# EAGLE design AudioAppBoard-0BAC0606 (EAGLE 5.10)
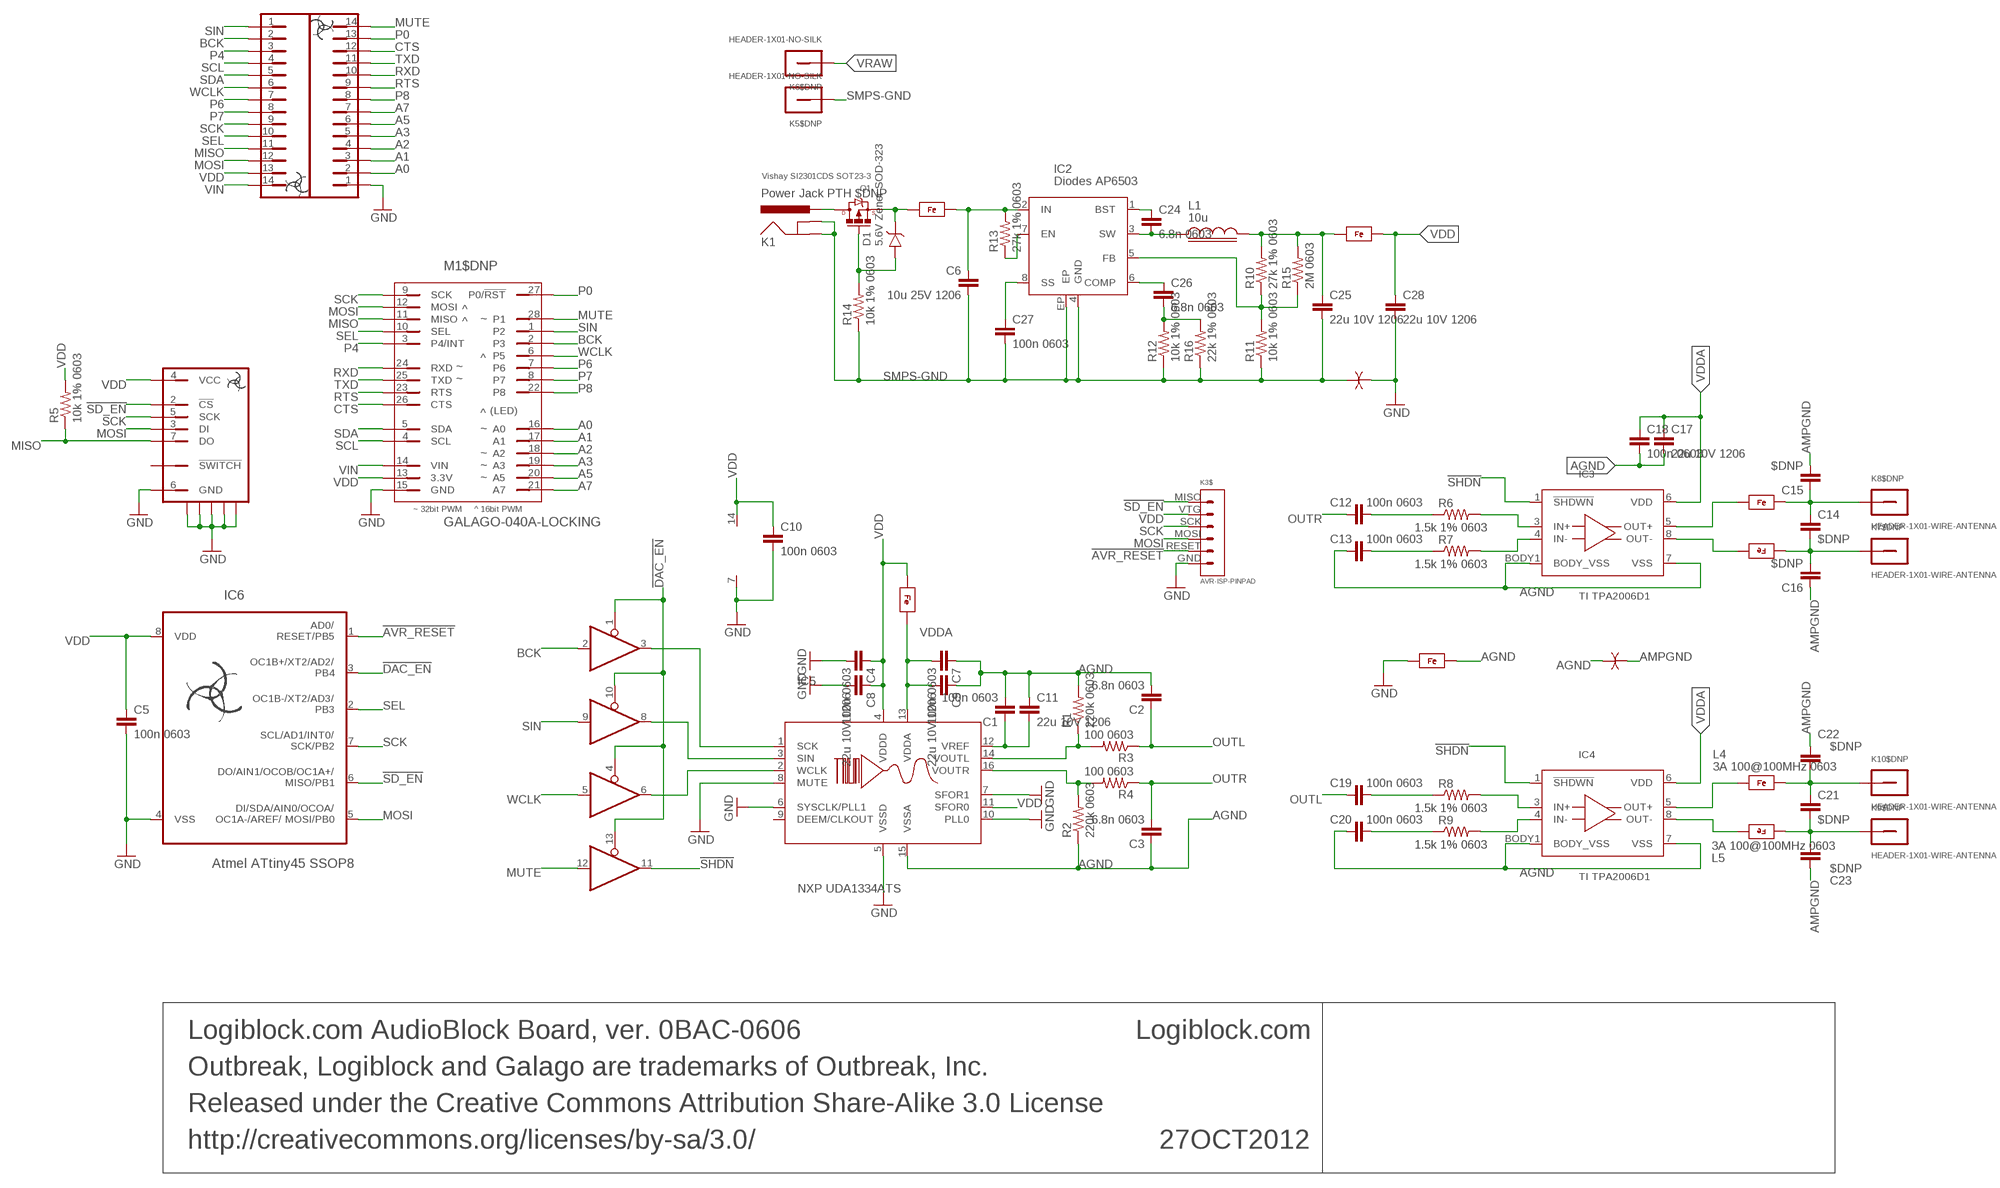
[diagram p0: schematic, sheet 1]

## Parts
27OCT2012  Logiblock.com AudioBlock Board, ver. 0BAC-0606  INFO-BLOCK  [INFO-BLOCK]
C1  100n 0603  CAP-0603  [0603]
C2  6.8n 0603  CAP-0603  [0603]
C3  6.8n 0603  CAP-0603  [0603]
C4  100n 0603  CAP-0603  [0603]
C5  100n 0603  CAP-0603  [0603]
C6  10u 25V 1206  CAP-1206  [1206]
C7  100n 0603  CAP-0603  [0603]
C8  22u 10V 1206  CAP-1206  [1206]
C9  22u 10V 1206  CAP-1206  [1206]
C10  100n 0603  CAP-0603  [0603]
C11  22u 10V 1206  CAP-1206  [1206]
C12  100n 0603  CAP-0603-MIN  [0603-MIN]
C13  100n 0603  CAP-0603-MIN  [0603-MIN]
C14  $DNP  CAP-0603-MIN  [0603-MIN]
C15  $DNP  CAP-0603-MIN  [0603-MIN]
C16  $DNP  CAP-0603-MIN  [0603-MIN]
C17  22u 10V 1206  CAP-1206  [1206]
C18  100n 0603  CAP-0603-MIN  [0603-MIN]
C19  100n 0603  CAP-0603-MIN  [0603-MIN]
C20  100n 0603  CAP-0603-MIN  [0603-MIN]
C21  $DNP  CAP-0603-MIN  [0603-MIN]
C22  $DNP  CAP-0603-MIN  [0603-MIN]
C23  $DNP  CAP-0603-MIN  [0603-MIN]
C24  6.8n 0603  CAP-0603-MIN  [0603-MIN]
C25  22u 10V 1206  CAP-1206  [1206]
C26  6.8n 0603  CAP-0603-MIN  [0603-MIN]
C27  100n 0603  CAP-0603-MIN  [0603-MIN]
C28  22u 10V 1206  CAP-1206  [1206]
D1  5.6V Zener SOD-323  DIODE-ZENER-SOD323  [SOD323]
FB1  3A 100@100MHz 0603  FERRITE-BEAD-0603  [0603]
FB2  3A 100@100MHz 0603  FERRITE-BEAD-0603  [0603]
FB3  3A 100@100MHz 0603  FERRITE-BEAD-0603  [0603]
FB4  3A 100@100MHz 0603  FERRITE-BEAD-0603-MIN  [0603-MIN]
IC1  74HC125-TSSOP14  [TSSOP14]
IC2  Diodes AP6503  SWITCHING-REGULATOR-VARIABLE-BUCK-DIODES-AP6503  [EIAJ-SOIC8-3.9MM-EXPOSED-PAD]
IC3  TI TPA2006D1  AMP-AUDIO-CLASS-D-TI-TPA2006A  [QFN8-3X3MM-TI-TPA200X]
IC4  TI TPA2006D1  AMP-AUDIO-CLASS-D-TI-TPA2006A  [QFN8-3X3MM-TI-TPA200X]
IC5  NXP UDA1334ATS  AUDIO-DAC-NXP-UDA1334ATS  [TSSOP16]
IC6  Atmel ATtiny45 SSOP8  AVR-ATTINY25/45/85-TSSOP8  [TSSOP8-4.4MM]
K1  Power Jack PTH $DNP  POWER_JACKPTH  [POWER_JACK_PTH]
K2  HIROSE-DM3D-SF-MICROSD  SD-OR-MICROSD-SPI-MODE-WITH-SWITCH-HIROSE-DM3D-SF  [HIROSE-MICROSD-SOCKET-DM3D-SF]
K2$DNP  HEADER-1X14-NO-SILK-CHUNKY  [HEADER-1X14-NO-SILK-CHUNKY]
K3$  AVR-ISP-PINPAD  [AVR-ISP-PINPAD]
K4$DNP  HEADER-1X14-NO-SILK-CHUNKY  [HEADER-1X14-NO-SILK-CHUNKY]
K5$DNP  HEADER-1X01-NO-SILK  [HEADER-1X01-NO-SILK]
K6$DNP  HEADER-1X01-NO-SILK  [HEADER-1X01-NO-SILK]
K7$DNP  HEADER-1X01-WIRE-ANTENNA  [HEADER-1X01-WIRE-ANTENNA]
K8$DNP  HEADER-1X01-WIRE-ANTENNA  [HEADER-1X01-WIRE-ANTENNA]
K9$DNP  HEADER-1X01-WIRE-ANTENNA  [HEADER-1X01-WIRE-ANTENNA]
K10$DNP  HEADER-1X01-WIRE-ANTENNA  [HEADER-1X01-WIRE-ANTENNA]
L1  10u  INDUCTOR-6X6MM  [INDUCTOR-SMD-6X6MM]
L2  3A 100@100MHz 0603  FERRITE-BEAD-0603-MIN  [0603-MIN]
L3  3A 100@100MHz 0603  FERRITE-BEAD-0603-MIN  [0603-MIN]
L4  3A 100@100MHz 0603  FERRITE-BEAD-0603-MIN  [0603-MIN]
L5  3A 100@100MHz 0603  FERRITE-BEAD-0603-MIN  [0603-MIN]
M1$DNP  GALAGO-040A-LOCKING  [GALAGO-LOCKING]
Q1  Vishay SI2301CDS SOT23-3  MOSFET-P-CHANNEL-VISHAY-SI2301  [SOT23-3]
R1  220k 0603  RESISTOR-0603  [0603]
R2  220k 0603  RESISTOR-0603  [0603]
R3  100 0603  RESISTOR-0603  [0603]
R4  100 0603  RESISTOR-0603  [0603]
R5  10k 1% 0603  RESISTOR-0603-MIN  [0603-MIN]
R6  1.5k 1% 0603  RESISTOR-0603-MIN  [0603-MIN]
R7  1.5k 1% 0603  RESISTOR-0603-MIN  [0603-MIN]
R8  1.5k 1% 0603  RESISTOR-0603-MIN  [0603-MIN]
R9  1.5k 1% 0603  RESISTOR-0603-MIN  [0603-MIN]
R10  27k 1% 0603  RESISTOR-0603-MIN  [0603-MIN]
R11  10k 1% 0603  RESISTOR-0603-MIN  [0603-MIN]
R12  10k 1% 0603  RESISTOR-0603-MIN  [0603-MIN]
R13  27k 1% 0603  RESISTOR-0603-MIN  [0603-MIN]
R14  10k 1% 0603  RESISTOR-0603-MIN  [0603-MIN]
R15  2M 0603  RESISTOR-0603-MIN  [0603-MIN]
R16  22k 1% 0603  RESISTOR-0603-MIN  [0603-MIN]
U1$  GND-ISOLATOR-0.008"  [GND-ISOLATOR-0.008"]
U2$  GND-ISOLATOR-0.008"  [GND-ISOLATOR-0.008"]

## Nets
!AVR_RESET: IC6.1(RESET/PB5) K3$.RESET
!DAC_EN: IC1.1(EN) IC1.4(EN) IC1.10(EN) IC1.13(EN) IC6.3(PB4)
!SD_EN: IC6.6(MISO/PB1) K2.2(!CS) K3$.MISO
!SHDN: IC1.11(Y) IC3.1(!SHDWN) IC4.1(!SHDWN)
A0: K4$DNP.2 M1$DNP.16(A0)
A1: K4$DNP.3 M1$DNP.17(A1)
A2: K4$DNP.4 M1$DNP.18(A2)
A3: K4$DNP.5 M1$DNP.19(A3)
A5: K4$DNP.6 M1$DNP.20(A5)
A7: K4$DNP.7 M1$DNP.21(A7)
AGND: C1.1 C2.1 C3.2 C7.2 C9.2 C11.2 C13.2 C17.1 C18.1 C20.2 FB4.2 IC3.7(VSS) IC3.BODY1(BODY_VSS) IC4.7(VSS) IC4.BODY1(BODY_VSS) IC5.15(VSSA) R1.2 R2.1 U2$.1(A)
AMPGND: C15.1 C16.2 C22.1 C23.2 U2$.2(B)
BCK: IC1.2(A) K2$DNP.2 M1$DNP.2(P3)
CTS: K4$DNP.12 M1$DNP.26(CTS)
DAC_SCK: IC1.3(Y) IC5.1(SCK)
DAC_SIN: IC1.8(Y) IC5.3(SIN)
DAC_WCLK: IC1.6(Y) IC5.2(WCLK)
GND: C4.1 C5.1 C8.1 C10.1 C28.1 FB4.1 IC1.7(VSS) IC5.5(VSSD) IC5.6(SYSCLK/PLL1) IC5.7(SFOR1) IC5.8(MUTE) IC5.10(PLL0) IC6.4(VSS) K2.6(GND) K2.PP$1 K2.PP$2 K2.PP$3 K2.PP$4 K2.PP$5 K3$.GND K4$DNP.1 M1$DNP.15(GND) U1$.2(B)
MISO: K2$DNP.11 K2.7(DO) M1$DNP.11(MISO) R5.1
MOSI: IC6.5(MOSI/PB0) K2$DNP.12 K2.3(DI) K3$.MOSI M1$DNP.12(MOSI)
MUTE: IC1.12(A) K4$DNP.14 M1$DNP.28(P1)
N$1: C14.2 C15.2 K8$DNP.1 L2.2
N$2: IC4.5(OUT+) L4.1
N$3: IC3.5(OUT+) L2.1
N$4: IC3.8(OUT-) L3.2
N$5: C12.1 R6.1
N$6: D1.A Q1.1(GATE) R14.2
N$7: C13.1 R7.1
N$8: IC3.4(IN-) R7.2
N$9: IC3.3(IN+) R6.2
N$10: C14.1 C16.1 K7$DNP.1 L3.1
N$11: IC4.8(OUT-) L5.2
N$12: C19.1 R8.1
N$13: C20.1 R9.1
N$14: IC4.4(IN-) R9.2
N$15: IC4.3(IN+) R8.2
N$18: C21.2 C22.2 K10$DNP.1 L4.2
N$19: C21.1 C23.1 K9$DNP.1 L5.1
N$23: D1.K FB1.1 Q1.2(SOURCE)
N$27: C26.1 R12.2 R16.2
OUTL: C2.2 C19.2 R3.1
OUTR: C3.1 C12.2 R4.1
P0: K4$DNP.13 M1$DNP.27(P0/!RST)
P4: K2$DNP.3 M1$DNP.3(P4/INT)
P6: K2$DNP.7 M1$DNP.7(P6)
P7: K2$DNP.8 M1$DNP.8(P7)
P8: K4$DNP.8 M1$DNP.22(P8)
RTS: K4$DNP.9 M1$DNP.23(RTS)
RXD: K4$DNP.10 M1$DNP.24(RXD)
SCK: IC6.7(SCK/PB2) K2$DNP.9 K2.5(SCK) K3$.SCK M1$DNP.9(SCK)
SCL: K2$DNP.4 M1$DNP.4(SCL)
SDA: K2$DNP.5 M1$DNP.5(SDA)
SEL: IC6.2(PB3) K2$DNP.10 M1$DNP.10(SEL)
SIN: IC1.9(A) K2$DNP.1 M1$DNP.1(P2)
SMPS-BST: C24.2 IC2.1(BST)
SMPS-COMP: C26.2 IC2.6(COMP)
SMPS-EN: IC2.7(EN) R13.1
SMPS-FB: IC2.5(FB) R10.1 R11.2 R15.1
SMPS-GND: C6.1 C25.1 C27.1 IC2.4(GND) IC2.EP K1.GND K1.GNDBREAK K5$DNP.1 R11.1 R12.1 R14.1 R16.1 U1$.1(A)
SMPS-IN: C6.2 FB1.2 IC2.2(IN) R13.2
SMPS-OUT: C25.2 FB2.1 L1.2 R10.2 R15.2
SMPS-SS: C27.2 IC2.8(SS)
SMPS-SW: C24.1 IC2.3(SW) L1.1
TXD: K4$DNP.11 M1$DNP.25(TXD)
VDD: C4.2 C5.2 C8.2 C10.2 C28.2 FB2.2 FB3.1 IC1.14(VDD) IC5.4(VDDD) IC5.11(SFOR0) IC6.8(VDD) K2$DNP.13 K2.4(VCC) K3$.VTG M1$DNP.13(3.3V) R5.2
VDDA: C7.1 C9.1 C17.2 C18.2 FB3.2 IC3.6(VDD) IC4.6(VDD) IC5.13(VDDA)
VIN: K2$DNP.14 M1$DNP.14(VIN)
VOUTL: IC5.14(VOUTL) R1.1 R3.2
VOUTR: IC5.16(VOUTR) R2.2 R4.2
VRAW: K1.PWR K6$DNP.1 Q1.3(DRAIN)
VREF: C1.2 C11.1 IC5.12(VREF)
WCLK: IC1.5(A) K2$DNP.6 M1$DNP.6(P5)
Unconnected: IC5.9(DEEM/CLKOUT) K2.SWITCH(!SWITCH)

## Library data of the parts
27OCT2012 = Outbreak:INFO-BLOCK
C1-C28 = Outbreak:CAP
D1 = Outbreak:DIODE-ZENER
FB1-FB4 L2-L5 = Outbreak:FERRITE-BEAD
IC1 = Outbreak:74HC125
IC2 = Outbreak:SWITCHING-REGULATOR-VARIABLE-BUCK-DIODES-AP6503
IC3 IC4 = Outbreak:AMP-AUDIO-CLASS-D-TI-TPA2006A
IC5 = Outbreak:AUDIO-DAC-NXP-UDA1334ATS
IC6 = Outbreak:AVR-ATTINY25/45/85
K1 = Outbreak:POWER_JACK: Power Jack This is the standard 5.5mm barrel jack for power. The PTH is the most common, proven, reliable, footprint. All others are experimental. The Slot footprint only works if the mill layer is transmitted to the PCB fab house so be warned. Spark Fun Electronics SKU : PRT-00119. Mating wall wart : TOL-00298 (and others)
K2 = Outbreak:SD-OR-MICROSD-SPI-MODE-WITH-SWITCH
K2$DNP K4$DNP = Outbreak:HEADER-1X14-NO-SILK
K3$ = Outbreak:AVR-ISP-PINPAD
K5$DNP K6$DNP K7$DNP K8$DNP K9$DNP K10$DNP = Outbreak:HEADER-1X01
L1 = Outbreak:INDUCTOR
M1$DNP = Outbreak-v0:GALAGO-040A
Q1 = Outbreak:MOSFET-P-CHANNEL
R1-R16 = Outbreak:RESISTOR: Resistor Basic schematic elements and footprints for 0603, 1206, and PTH resistors.
U1$ U2$ = Outbreak:GND-ISOLATOR

## Board
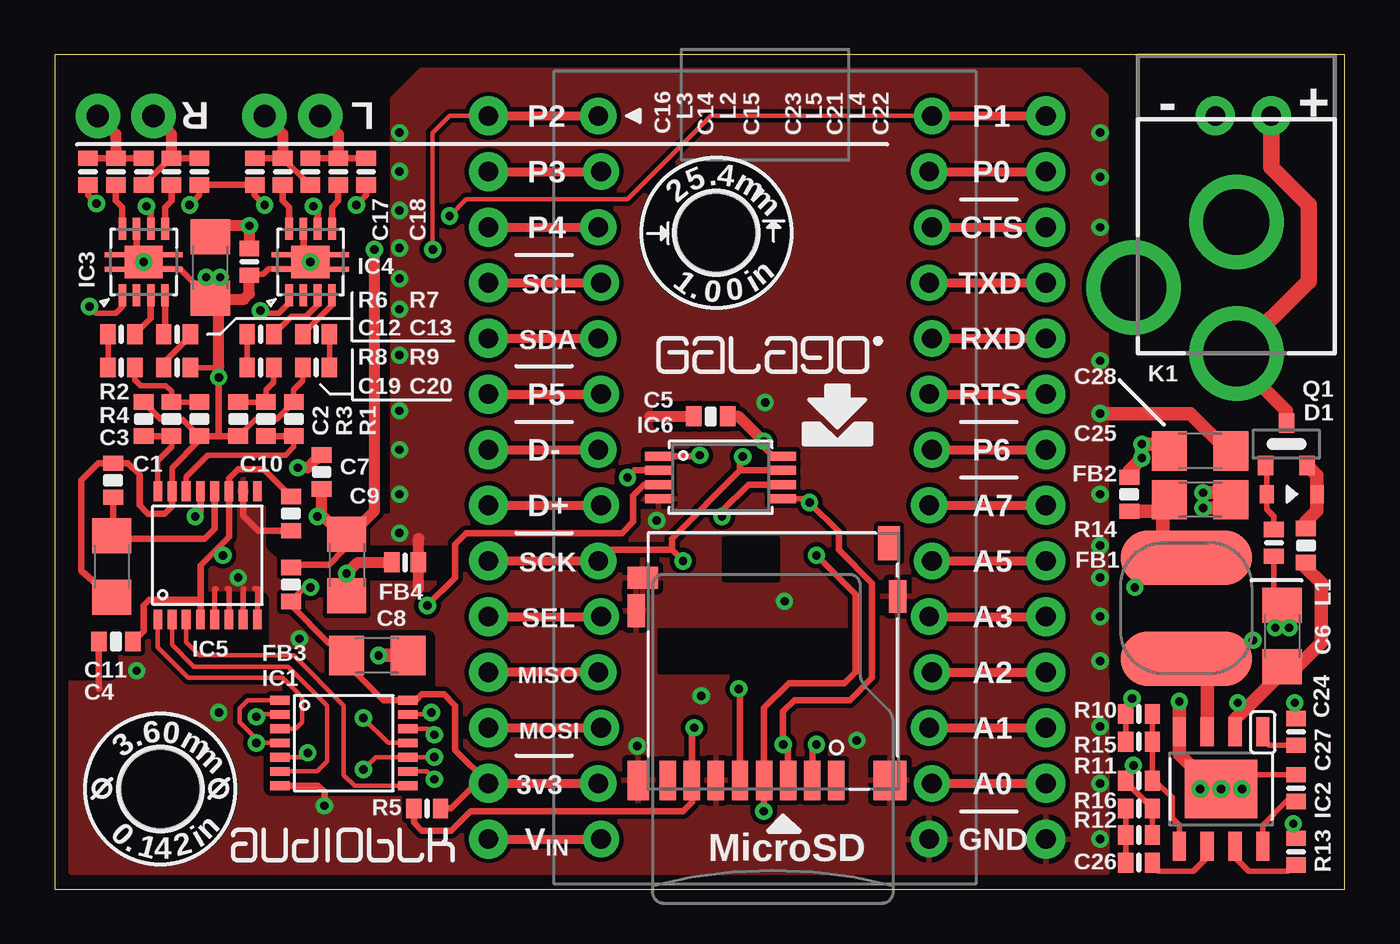
[diagram p1: board, top side]
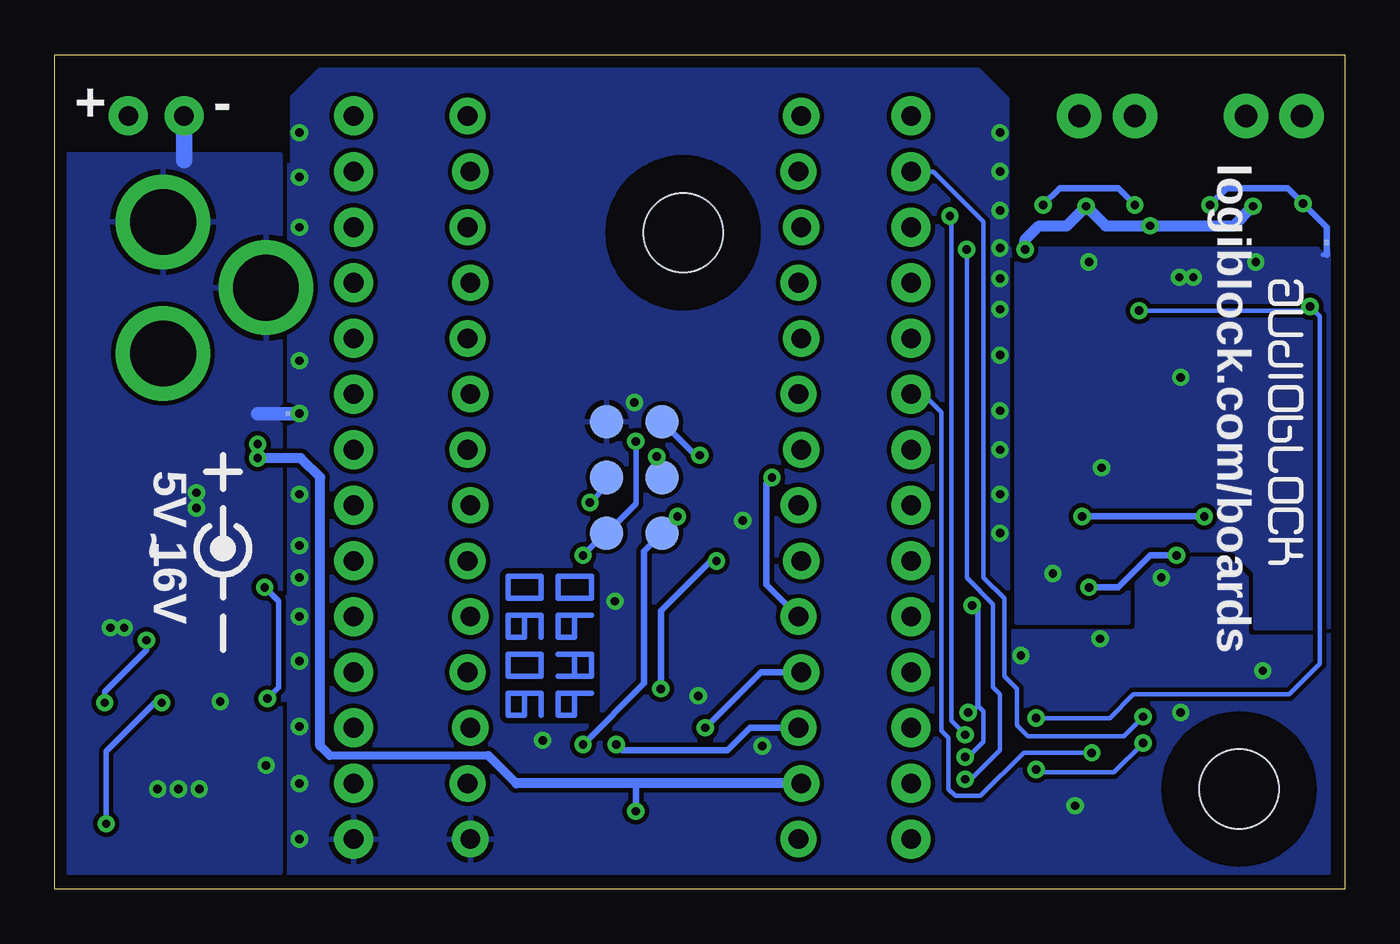
[diagram p2: board, bottom side, seen from below]

Size 58.93 x 38.1 mm. Coordinates in mm from the lower left corner, seen from the top.
Outline: 0,0 58.93,0 58.93,38.1 0,38.1 0,0
Copper layers (1*16): Top 0.035mm / dielectric 1.5mm / Bottom 0.035mm
Design rules: minimum track width 8mil, minimum drill 15mil, track to track 8mil, track to pad 8mil, pad to pad 8mil, via to via 8mil, smd to smd 8mil, copper to edge 20mil, drill to drill 8mil, minimum pad ring 10mil, minimum via ring 8mil, stop-mask expansion 4mil, vias tented up to drill 20mil, thermal gap 10mil
tRestrict: area 27.7,21.3 to 30.8,21.9; area 0.5,9.9 to 2.5,11.7; area 6.6,11.2 to 9.4,13.2; area 9.9,4.6 to 17.3,6.6; area 10,15.5 to 11.9,18; area 12.7,9.4 to 17,11.5; area 14.4,14.5 to 18,15.3
bRestrict: area 34.4,7.9 to 38.2,14.3

### Footprints (pad centres in the part's own frame; a part is rotated, then mirrored left to right if it is on the bottom)
0603 = smd 0.7 x 0.9: 1 -0.777,0; 2 0.777,0
1206 = smd 1.6 x 1.8: 1 -1.4,0; 2 1.4,0
0603-MIN = smd 0.7 x 0.9: 1 -0.61,0; 2 0.61,0
SOD323 = smd 0.63 x 0.83: A -1.15,0; K 1.15,0
TSSOP14 = smd 0.4 x 0.9: 1 2.275,2.925; 2 1.625,2.925; 3 0.975,2.925; 4 0.325,2.925; 5 -0.325,2.925; 6 -0.975,2.925; 7 -1.625,2.925; 8 -1.625,-2.925; 9 -0.975,-2.925; 10 -0.325,-2.925; 11 0.325,-2.925; 12 0.975,-2.925; 13 1.625,-2.925; 14 2.275,-2.925
EIAJ-SOIC8-3.9MM-EXPOSED-PAD = smd 1.321 x 0.61: 1 -2.618,1.905; 2 -2.618,0.635; 3 -2.618,-0.635; 4 -2.618,-1.905; 5 2.618,-1.905; 6 2.618,-0.635; 7 2.618,0.635; 8 2.618,1.905 | smd 2.66 x 3.3: EP 0,0
QFN8-3X3MM-TI-TPA200X = smd 0.35 x 1: 1 0.975,1.525; 2 0.325,1.525; 3 -0.325,1.525; 4 -0.975,1.525; 5 -0.985,-1.525; 6 -0.325,-1.525; 7 0.325,-1.525; 8 0.975,-1.525 | smd 1.75 x 1.5: BODY1 0,0 | smd 0.9 x 0.23: BODY2 -1.325,0.325; BODY3 -1.325,-0.325; BODY4 1.325,-0.325; BODY5 1.325,0.325
TSSOP16 = smd 0.4 x 0.9: 1 2.275,2.925; 2 1.625,2.925; 3 0.975,2.925; 4 0.325,2.925; 5 -0.325,2.925; 6 -0.975,2.925; 7 -1.625,2.925; 8 -2.275,2.925; 9 -2.275,-2.925; 10 -1.625,-2.925; 11 -0.975,-2.925; 12 -0.325,-2.925; 13 0.325,-2.925; 14 0.975,-2.925; 15 1.625,-2.925; 16 2.275,-2.925
TSSOP8-4.4MM = smd 1.25 x 0.42: 1 -2.825,0.975; 2 -2.825,0.325; 3 -2.825,-0.325; 4 -2.825,-0.975; 5 2.825,-0.975; 6 2.825,-0.325; 7 2.825,0.325; 8 2.825,0.975
POWER_JACK_PTH = drill 2.997 pad 4.318: GND 0,7.7; GNDBREAK 4.7,10.7; PWR 0,13.7
HIROSE-MICROSD-SOCKET-DM3D-SF = smd 0.75 x 1.8: 1 2.62,-4.18; 2 1.52,-4.18; 3 0.42,-4.18; 4 -0.68,-4.18; 5 -1.78,-4.18; 6 -2.88,-4.18; 7 -3.98,-4.18; 8 -5.08,-4.18 | smd 1.4 x 1: PP$1 -6.23,5.07 | smd 0.8 x 1.5: PP$2 -6.53,3.57; PP$5 5.42,4.22 | smd 1 x 1.8: PP$3 -6.43,-4.18 | smd 1.5 x 1.8: PP$4 5.07,-4.18 | smd 1 x 1.55: SWITCH 5.02,6.645
HEADER-1X14-NO-SILK-CHUNKY = drill 0.9 pad 1.778: 1 0,0; 2 2.54,0; 3 5.08,0; 4 7.62,0; 5 10.16,0; 6 12.7,0; 7 15.24,0; 8 17.78,0; 9 20.32,0; 10 22.86,0; 11 25.4,0; 12 27.94,0; 13 30.48,0; 14 33.02,0
AVR-ISP-PINPAD = smd 1.524 x 1.524: GND 2.54,1.27; MISO -2.54,-1.27; MOSI 0,1.27; RESET 2.54,-1.27; SCK 0,-1.27; VTG -2.54,1.27
HEADER-1X01-NO-SILK = drill 0.9 pad 1.778: 1 0,0
HEADER-1X01-WIRE-ANTENNA = drill 1.016 pad 2.032: 1 0,0
INDUCTOR-SMD-6X6MM = smd 2.5 x 6: 1 -2.3,0; 2 2.3,0
GALAGO-LOCKING = drill 0.9 pad 1.651: 1 -7.62,16.51; 2 -7.493,13.97; 3 -7.62,11.43; 4 -7.493,8.89; 5 -7.62,6.35; 6 -7.493,3.81; 7 -7.62,1.27; 8 -7.493,-1.27; 9 -7.62,-3.81; 10 -7.493,-6.35; 11 -7.62,-8.89; 12 -7.493,-11.43; 13 -7.62,-13.97; 14 -7.493,-16.51; 15 7.493,-16.51; 16 7.62,-13.97; 17 7.493,-11.43; 18 7.62,-8.89; 19 7.493,-6.35; 20 7.62,-3.81; 21 7.493,-1.27; 22 7.62,1.27; 23 7.493,3.81; 24 7.62,6.35; 25 7.493,8.89; 26 7.62,11.43; 27 7.493,13.97; 28 7.62,16.51
SOT23-3 = smd 0.7 x 0.9: 1 0.95,0.97; 2 -0.95,0.97; 3 0,-0.97
GND-ISOLATOR-0.008" = smd 0.203 x 0.203: 1 -0.025,0; 2 0.025,0
MOUNTING-HOLE-3.6MM-LABELLED-DIAM = hole 3.619: 0,0
MOUNTING-HOLE-3.6MM-LABELLED-DISTANCE = hole 3.619: 0,0

### Placement (x,y rotation side)
27OCT2012  -11.43,-5.08 0 top  (outside the outline)
C1  2.67,18.67 270 top
C2  8.38,21.46 90 top
C3  6.6,21.46 270 top
C4  2.79,11.3 0 top
C5  29.97,21.59 0 top
C6  56.07,11.56 270 top
C7  12.19,19.05 90 top
C8  14.73,10.67 180 top
C9  13.34,14.8 270 top
C10  10.79,17.14 90 top
C11  2.6,14.73 270 top
C12  3.05,23.81 0 top
C13  5.59,23.81 0 top
C14  4.06,32.77 270 top
C15  6.6,32.77 90 top
C16  1.52,32.77 270 top
C17  7.11,28.38 90 top
C18  8.89,28.64 90 top
C19  9.4,23.81 0 top
C20  11.94,23.81 180 top
C21  11.68,32.77 90 top
C22  14.22,32.77 90 top
C23  9.14,32.77 270 top
C24  56.71,7.18 270 top
C25  52.32,17.78 180 top
C26  49.53,1.21 0 top
C27  56.71,4.62 270 top
C28  52.32,20 180 top
D1  56.52,18.03 0 top
FB1  57.15,15.68 270 top
FB2  49.09,18.03 90 top
FB3  10.79,13.91 90 top
FB4  16,14.92 180 top
IC1  13.21,6.35 90 top
IC2  53.28,4.57 270 top
IC3  4.06,28.64 180 top
IC4  11.68,28.64 180 top
IC5  6.99,15.24 180 top
IC6  30.42,18.8 0 top
K1  53.98,38.16 180 top
K2  33.08,9.14 0 top
K2$DNP  19.81,35.31 270 top
K3$  32.45,18.8 90 bottom
K4$DNP  45.28,2.29 90 top
K5$DNP  53.02,35.31 0 top
K6$DNP  55.56,35.31 0 top
K7$DNP  1.97,35.31 0 top
K8$DNP  4.51,35.31 0 top
K9$DNP  9.59,35.31 0 top
K10$DNP  12.13,35.31 0 top
L1  51.69,12.83 90 top
L2  5.33,32.77 90 top
L3  2.79,32.77 270 top
L4  12.95,32.77 90 top
L5  10.41,32.77 270 top
M1$DNP  32.45,18.8 0 top
Q1  56.26,20.32 180 top
R1  10.92,21.46 90 top
R2  4.06,21.46 270 top
R3  9.65,21.46 270 top
R4  5.33,21.46 270 top
R5  17.02,3.68 0 top
R6  150k 1% 0603  [0603-MIN]  3.05,25.34 0 top
R7  150k 1% 0603  [0603-MIN]  5.59,25.34 180 top
R8  150k 1% 0603  [0603-MIN]  9.4,25.34 0 top
R9  150k 1% 0603  [0603-MIN]  11.94,25.34 180 top
R10  49.53,8 180 top
R11  49.53,4.95 0 top
R12  49.53,2.48 180 top
R13  56.71,1.71 90 top
R14  55.69,15.81 90 top
R15  49.53,6.73 180 top
R16  49.53,3.68 180 top
U1$  48.26,21.72 0 bottom
U2$  0.83,29.53 90 bottom
U$1  [GALAGO-LOGO]  32.45,24.38 0 top
U$3  [GALAGO-APP-BOARD-SYMBOL]  35.75,21.08 0 top
U$10  [MOUNTING-HOLE-3.6MM-LABELLED-DIAM]  4.83,4.57 0 top
U$11  [MOUNTING-HOLE-3.6MM-LABELLED-DISTANCE]  30.23,29.97 0 top

### Tracks (layer width: path | path; a pad name or v marks a point on that pad's centre or on a via)
!AVR_RESET  (via drill 0.38)
  Top 0.305: v29.46,19.81 29.42,19.77 IC6.1
  Bottom 0.305: K3$.RESET 29.65,19.81 v29.46,19.81
!DAC_EN  (via drill 0.38)
  Top 0.203: IC1.4 9.28,6.67 v9.21,6.67 9.21,6.86 8.45,7.62 8.45,8.26 8.82,8.62 IC1.1 | v17.34,6.03 17.33,6.03 IC1.10 14.66,6.03 v14.1,5.46 | IC1.13 17.12,7.97 v17.21,8.06
  Top 0.305: IC6.3 26.92,18.47 26.42,17.97 26.42,16.76 25.91,16.26 18.8,16.26 18.29,15.75 18.29,14.22 v17.02,12.95
  Bottom 0.203: v14.1,5.46 13.97,5.33 10.54,5.33 v9.21,6.67 | v17.34,6.03 17.21,6.03 16.51,6.73 16.51,8.13 16.76,8.38 17.08,8.06 v17.21,8.06
  Bottom 0.254: 16.76,8.38 16.76,12.7 v17.02,12.95
!SD_EN  (via drill 0.38)
  Top 0.305: K2.2 34.6,6.41 v34.8,6.6 | v30.48,17.02 30.48,17.27 31.68,18.47 IC6.6
  Bottom 0.305: v34.8,6.6 32,9.4 32,15.43 K3$.MISO 31.18,16.32 v30.48,17.02
!SHDN  (via drill 0.38)
  Top 0.203: IC1.11 15.23,6.67 v14.1,7.81
  Top 0.254: IC3.1 3.09,26.58 2.79,26.29 1.91,26.29 v1.59,26.61 | IC4.1 10.71,26.77 10.22,26.29 9.53,26.29 v9.4,26.42
  Bottom 0.203: v9.4,26.42 1.78,26.42 v1.59,26.61 1.14,26.16 1.14,10.29 2.54,8.89 9.65,8.89 10.73,7.81 v14.1,7.81
A0
  Top 0.406: M1$DNP.16 K4$DNP.2
A1
  Top 0.406: M1$DNP.17 K4$DNP.3
A2
  Top 0.406: M1$DNP.18 K4$DNP.4
A3
  Top 0.406: M1$DNP.19 K4$DNP.5
A5
  Top 0.406: M1$DNP.20 K4$DNP.6
A7
  Top 0.406: M1$DNP.21 K4$DNP.7
AGND  (via drill 0.38)
  Top 0.254: C2.1 9.17,21.46 10.14,21.46 R1.2 10.92,22.8 11.33,23.2 C20.2 | R2.1 4.84,21.46 5.82,21.46 C3.2 6.6,20.49 5.36,19.24 IC5.15 | C13.2 7.49,23.81 7.49,23.88 | IC3.BODY1 4.38,28.32 5.71,28.32 7.05,26.98 C17.1 | IC4.BODY1 11.37,28.32 9.78,28.32 9.53,28.07 8.89,28.07 C18.1 | 6.92,27.37 v6.92,27.94
  Top 0.305: IC3.7 3.74,28.96 IC3.BODY1 | IC4.7 11.36,28.96 IC4.BODY1 | C11.2 1.21,14.53 1.21,18.67 1.99,19.46 C1.1 3.34,19.46 3.87,18.92 3.87,17.53 4.25,17.14 5.02,17.14 5.36,17.49 IC5.15 | C3.2 7.49,20.69 | 7.49,20.69 C2.1 | 7.49,20.69 v7.49,23.37
  Top 0.508: C18.1 8.89,27.18 8.64,26.92 7.49,26.92 | C17.1 7.11,26.92 7.49,26.92 | v7.49,23.37 7.49,23.88 7.49,26.92 | v11.11,19.24 11.53,19.24 C7.2 | C9.2 v13.34,14.41 13.84,14.92 FB4.2
  Bottom 0.203: 0.83,28.96 1.02,28.96
  Bottom 0.305: U2$.1 0.83,28.96
  other vias: 4.06,28.64 11.68,28.64 7.56,27.94
  pour Bottom: 0.76,29.21 0.76,11.94 4.06,11.94 4.06,14.48 5.08,15.49 8.89,15.49 9.91,14.48 9.91,12.19 14.99,12.19 14.99,29.21
AMPGND  (via drill 0.38)
  Top 0.305: v6.16,31.24 6.6,31.69 C15.1 C23.2 9.14,31.69 v9.59,31.24 | C16.2 1.52,31.69 v1.91,31.3 | C22.1 14.22,31.69 v13.78,31.24
  Bottom 0.203: v1.91,31.3 1.91,31.37
  Bottom 0.305: v6.16,31.24 5.4,32 2.6,32 v1.91,31.3 0.83,30.23 U2$.2 | v13.78,31.24 13.02,32 10.35,32 v9.59,31.24
BCK  (via drill 0.38)
  Top 0.203: IC1.2 9.24,7.97 v9.21,7.87
  Top 0.406: K2$DNP.2 M1$DNP.2
  Bottom 0.203: v9.21,7.87 10.1,6.99 14.48,6.99 14.99,7.49 14.99,9.14 15.56,9.72 15.56,13.27 16.51,14.22 16.51,30.48 18.8,32.77 K2$DNP.2
CTS
  Top 0.406: M1$DNP.26 K4$DNP.12
DAC_SCK
  Top 0.203: IC1.3 11.01,7.33 11.3,7.62 11.3,8.76 10.41,9.65 6.1,9.65 4.71,11.04 IC5.1
DAC_SIN
  Top 0.203: IC5.3 6.01,11.26 6.6,10.67 10.92,10.67 13.21,8.38 13.21,5.21 13.69,4.72 IC1.8
DAC_WCLK
  Top 0.203: IC1.6 11.98,5.38 12.45,5.84 12.45,8.38 10.67,10.16 6.35,10.16 5.36,11.15 IC5.2
GND  (via drill 0.38)
  Top 0.254: IC5.5 7.31,13.72 7.37,13.72 | IC5.6 7.96,13.72 7.87,13.72 | IC5.7 8.61,13.72 8.64,13.72 | IC5.8 9.26,13.72 9.14,13.72
  Top 0.305: IC5.10 8.61,17.04 9.29,16.37 C10.1 | C4.1 2.02,9.16 2.03,9.14 | IC1.7 12.04,4.72 12.32,4.45 v12.32,3.81
  Top 0.508: 27.18,21.59 C5.1 | FB4.1 16.61,16 16.64,16 | 16.61,13.72 16.61,14.8
  Top 0.61: v47.75,21.72 51.88,21.72 53.6,20 C28.1 | v14.8,10.67 C8.1
  Bottom 0.61: U1$.2 v47.75,21.72
  other vias: 8.38,14.22 3.75,9.97 26.61,6.54 29.53,8.83 33.34,13.14 32.45,22.23 27.5,16.83 36.64,6.79 15.75,34.54 15.75,32.77 15.75,29.27 15.75,26.48 15.75,24.38 15.75,21.84 15.75,20.07 15.75,16.26 15.75,30.99 15.75,27.88 15.75,18.03 11.18,11.43 7.49,8.06 47.75,7.43 47.75,10.41 47.75,12.45 47.75,24.13 47.75,18.03 47.75,15.68 47.75,14.22 47.75,30.23 47.75,32.51 47.75,34.54 47.75,4.83 47.75,2.29
  pour Top (rank 2): 15.44,36.07 16.76,37.4 46.8,37.4 48.01,36.2 48.07,0.76 0.76,0.76 0.76,10.92 3.81,10.92 3.81,14.48 1.02,14.48 1.02,19.05 12.19,19.05 12.19,17.02 15.44,17.02
  pour Bottom (rank 2): 0.76,29.21 15.44,29.21 15.44,36.07 16.76,37.4 46.8,37.4 48.07,36.13 48.07,33.02 58.29,33.02 58.29,0.76 0.76,0.76
MISO  (via drill 0.38)
  Top 0.305: v29.21,7.37 29.1,7.26 K2.7 29.1,3.96 28.7,3.56 18.99,3.56 18.1,2.67 16.76,2.67 16.41,3.02 R5.1
  Top 0.406: M1$DNP.11 K2$DNP.11
  Bottom 0.305: v29.21,7.37 26.67,9.91 M1$DNP.11
MOSI  (via drill 0.38)
  Top 0.254: v34.48,17.65 34.31,17.82 IC6.5
  Top 0.305: K2.3 33.5,6.38 v33.27,6.6 33.27,8.13 33.78,8.64 36.32,8.64 37.34,9.65 37.34,13.97 35.81,15.49 35.81,16.32 v34.48,17.65
  Top 0.406: K2$DNP.12 M1$DNP.12
  Bottom 0.254: K3$.MOSI 33.72,18.41 v34.48,17.65
  Bottom 0.305: v33.27,6.6 33.02,6.35 28.19,6.35 27.18,7.37 M1$DNP.12 24.83,7.37
MUTE  (via drill 0.38)
  Top 0.203: v18.03,30.73 18.8,31.5 26.16,31.5 29.97,35.31 M1$DNP.28 | IC1.12 17.06,7.33 v17.34,7.05
  Top 0.406: M1$DNP.28 K4$DNP.14
  Bottom 0.203: v17.34,7.05 17.97,7.68 17.97,30.67 v18.03,30.73
N$1
  Top 0.305: C14.2 5.28,33.38 L2.2 C15.2
  Top 0.508: K8$DNP.1 5.33,34.48 L2.2
N$2
  Top 0.305: IC4.5 12.67,31.15 12.95,31.43 L4.1
N$3
  Top 0.305: IC3.5 5.05,31.15 5.33,31.43 L2.1
N$4
  Top 0.305: IC3.8 3.09,31.14 2.79,31.43 L3.2
N$5
  Top 0.254: R6.1 C12.1
N$6
  Top 0.254: Q1.1 55.37,19.3 D1.A 55.37,17.34 55.69,17.02 R14.2
N$7
  Top 0.254: R7.1 6.2,25.25 4.98,24.03 C13.1
N$8
  Top 0.305: IC3.4 5.04,25.59 R7.2
N$9
  Top 0.305: IC3.3 4.39,26.07 R6.2
N$10
  Top 0.305: C16.1 L3.1 C14.1
  Top 0.508: K7$DNP.1 2.79,34.48 L3.1
N$11
  Top 0.305: IC4.8 10.71,31.14 10.41,31.43 L5.2
N$12
  Top 0.254: R8.1 C19.1
N$13
  Top 0.254: R9.1 C20.1
N$14
  Top 0.254: R9.2 12.66,26.67 IC4.4
N$15
  Top 0.254: R8.2 10.83,26.16 11.49,26.16 12.01,26.68 IC4.3
N$16
  Bottom 0.254: 34.42,14.29 34.42,13.27 35.94,13.27 35.94,14.29 34.42,14.29
N$17
  Bottom 0.254: 35.18,12.51 35.94,12.51 35.94,11.49 35.18,11.49 35.18,12.51 | 35.18,12.51 34.42,12.51
N$18
  Top 0.305: C21.2 L4.2 C22.2
  Top 0.508: K10$DNP.1 12.95,34.48 L4.2
N$19
  Top 0.305: C23.1 L5.1 11.63,32.16 C21.1
  Top 0.508: K9$DNP.1 10.41,34.48 L5.1
N$20
  Bottom 0.254: 35.18,9.72 34.42,9.72 34.42,10.73 35.18,10.73 | 35.18,9.72 35.94,9.72 | 35.18,10.73 35.94,10.73 | 35.18,9.72 35.18,10.73
N$21
  Bottom 0.254: 35.18,8.95 35.94,8.95 35.94,7.94 35.18,7.94 35.18,8.95 | 35.18,8.95 34.42,8.95
N$22
  Bottom 0.254: 36.7,14.29 36.7,13.27 38.23,13.27 38.23,14.29 36.7,14.29
N$23
  Top 0.61: Q1.2 57.66,18.9 D1.K | D1.K 57.66,17.27 57.15,16.76 FB1.1 | D1.K
N$24
  Bottom 0.254: 36.7,11.49 36.7,12.51 37.47,12.51 | 37.47,12.51 38.23,12.51 38.23,11.49 37.47,11.49 37.47,12.51
N$25
  Bottom 0.254: 36.7,9.72 36.7,10.73 38.23,10.73 38.23,9.72 36.7,9.72
N$26
  Bottom 0.254: 37.47,8.95 37.47,7.94 38.23,7.94 38.23,8.95 37.47,8.95 | 37.47,8.95 36.7,8.95 36.7,7.94
N$27
  Top 0.254: C26.1 R12.2 R16.2
OUTL
  Top 0.254: C19.2 10.01,23.15 9.65,22.8 R3.1 C2.2
OUTR
  Top 0.254: C12.2 3.66,23.27 3.94,22.99 5.08,22.99 5.33,22.73 R4.1 C3.1
P0
  Top 0.406: M1$DNP.27 K4$DNP.13
P4
  Top 0.406: K2$DNP.3 M1$DNP.3
P6
  Top 0.406: K2$DNP.7 M1$DNP.7
P7
  Top 0.406: K2$DNP.8 M1$DNP.8
P8
  Top 0.406: M1$DNP.22 K4$DNP.8
RTS
  Top 0.406: M1$DNP.23 K4$DNP.9
RXD
  Top 0.406: M1$DNP.24 K4$DNP.10
SCK  (via drill 0.38)
  Top 0.305: K2.5 31.3,9.08 v31.24,9.14 | 28.19,15.49 v28.7,14.99 | 28.19,15.49 25.34,15.49 M1$DNP.9 | 31.31,19.12 IC6.7 | 31.31,19.12 28.19,16 28.19,15.49 | 31.31,19.12 31.31,19.63 v31.43,19.75
  Top 0.406: K2$DNP.9 M1$DNP.9
  Bottom 0.305: v31.24,9.14 31.24,12.7 28.96,14.99 v28.7,14.99 | K3$.SCK 31.18,19.49 v31.43,19.75
SCL
  Top 0.406: K2$DNP.4 M1$DNP.4
SDA
  Top 0.406: K2$DNP.5 M1$DNP.5
SEL  (via drill 0.38)
  Top 0.305: IC6.2 26.49,19.12 v26.16,18.8
  Top 0.406: K2$DNP.10 M1$DNP.10
  Bottom 0.305: v26.16,18.8 26.42,18.54 26.42,13.91 M1$DNP.10
SIN  (via drill 0.38)
  Top 0.203: v17.27,29.21 17.27,34.54 18.03,35.31 K2$DNP.1 | IC1.9 16.98,5.38 v17.34,5.02
  Top 0.406: K2$DNP.1 M1$DNP.1
  Bottom 0.203: v17.27,29.21 17.27,14.22 16.07,13.02 16.07,9.21 15.75,8.89 15.75,6.35 17.08,5.02 v17.34,5.02
SMPS-BST
  Top 0.254: IC2.1 55.18,6.86 55.47,6.57 C24.2
SMPS-COMP
  Top 0.254: IC2.6 52.64,1.46 52.01,0.83 50.42,0.83 50.14,1.1 C26.2
SMPS-EN
  Top 0.254: IC2.7 53.91,1.46 54.55,0.83 56.33,0.83 56.6,1.1 R13.1
SMPS-FB
  Top 0.254: IC2.5 51.37,2.92 51.05,3.24 51.05,4.19 50.23,4.95 R11.2 R15.1 R10.1
SMPS-GND  (via drill 0.38)
  Top 0.254: R12.1 R16.1 48.92,4.9 R11.1 48.92,5.3 v49.28,5.65 | C27.1 54.23,5.23 v54.23,4.57 IC2.EP v52.32,4.57 | R14.1 55.69,12.96 C6.1
  Top 0.61: IC2.EP 52.96,4.57 51.37,6.16 IC2.4 v51.37,8.57 | v55.75,11.94 55.75,12.64 C6.1 | C25.1 53.79,18.16 v52.45,18.1 | v52.45,17.4 53.78,17.46 | v56.39,11.94 56.39,12.64
  Bottom 0.61: U1$.1 49.66,21.72
  Bottom 0.762: K5$DNP.1 53.02,33.27
  other vias: 53.28,4.57
  pour Bottom: 48.64,33.53 58.29,33.53 58.29,0.76 48.64,0.76
SMPS-IN  (via drill 0.38)
  Top 0.254: v56.58,2.98 56.58,2.32 R13.2
  Top 0.61: IC2.2 53.91,7.75 54.26,8.1 | 54.26,8.1 56.07,9.9 C6.2 56.58,9.97 57.85,11.24 57.85,13.98 57.15,14.68 FB1.2 | v54.04,8.51 54.26,8.29 54.26,8.1
  Bottom 0.254: v56.58,2.98 56.58,6.29 54.36,8.51 v54.04,8.51
SMPS-OUT  (via drill 0.38)
  Top 0.254: R15.2 R10.2 48.92,8.41 v49.21,8.7 | v49.34,13.78 50.69,15.13 L1.2
  Top 0.61: 50.61,17.26 FB2.1 | 50.69,15.13 50.61,15.13 50.61,17.26 | 50.61,17.26 C25.2
  Bottom 0.254: v49.34,13.78 48.7,13.14 48.7,9.21 v49.21,8.7
SMPS-SS
  Top 0.254: IC2.8 55.18,2.92 56.27,4.01 C27.2
SMPS-SW  (via drill 0.38)
  Top 0.254: v56.64,8.51 56.64,7.79 C24.1 | v54.74,11.37 53.33,9.96 52.45,9.96
  Top 0.61: IC2.3 52.64,9.96 52.45,9.96 L1.1
  Bottom 0.254: v56.64,8.51 56.64,9.02 54.74,10.92 v54.74,11.37
TXD
  Top 0.406: M1$DNP.25 K4$DNP.11
VDD  (via drill 0.38)
  Top 0.254: v32.38,20.45 32.38,20.19 32.81,19.77 IC6.8
  Top 0.305: C10.2 9.55,19.18 8.38,19.18 7.96,18.75 IC5.11 7.96,16.09 7.37,15.49 | FB3.1 10.54,13.12 | C4.2 4.06,11.79 4.06,12.95 4.32,13.21 6.66,13.21 | FB3.1 10.79,12.95 12.5,11.25 13.32,11.25 C8.2 13.26,10.36 15,8.62 IC1.14 16.5,8.62 16.76,8.89 17.78,8.89 18.29,8.38 18.29,6.35 K2$DNP.13 19.24,4.83 18.1,3.68 R5.2 | 7.37,15.49 6.66,14.79 6.66,13.21 | 6.66,13.21 IC5.4 | v7.68,15.24 7.43,15.49 7.37,15.49 | v11.68,13.78 11.39,13.78 FB3.1 | v32.38,3.56 32.4,3.58 K2.4 32.4,8.27 33.53,9.4 36.07,9.4 36.58,9.91 36.58,13.46 v34.8,15.24
  Top 0.406: K2$DNP.13 M1$DNP.13
  Top 0.508: C5.2 31.24,21.59 v32.38,20.45
  Top 0.61: FB2.2 49.09,19.11 v49.66,19.68 v49.66,20.32 50.29,20.32 C28.2
  Bottom 0.254: K3$.VTG 32.38,17.59 v32.38,20.45
  Bottom 0.305: v7.68,15.24 8.89,15.24 10.35,13.78 v11.68,13.78 | 32.38,4.83 v32.38,3.56 | v34.8,15.24 33.78,16.26 K3$.VTG
  Bottom 0.356: 39.12,6.1 46.35,6.1
  Bottom 0.406: 37.85,4.83 39.12,6.1 | 46.35,6.1 46.8,6.54
  Bottom 0.457: M1$DNP.13 32.38,4.83 37.85,4.83 | 46.8,6.54 46.8,18.8 47.69,19.68 v49.66,19.68 v49.66,20.32
VDDA  (via drill 0.38)
  Top 0.305: IC5.13 6.66,17.27 v6.41,17.02 | 13.21,16.33 12.95,16.33 12.69,16.33 | 13.21,16.33 C9.1 | 13.21,16.33 13.21,15.49 12.53,14.82 10.79,14.82 FB3.2 | IC3.6 4.39,30.98 v4.19,31.18 | IC4.6 12.01,30.98 v11.81,31.18
  Top 0.508: C17.2 7.11,30.29 v8.89,30.29 C18.2 | C9.1 13.66,16.33 14.61,17.27 v14.61,29.21 | 12.95,16.33 12.27,17.02 v12,17.02 12.19,17.21 C7.1
  Bottom 0.305: v6.41,17.02 v12,17.02
  Bottom 0.508: v4.19,31.18 5.08,30.29 v8.89,30.29 10.92,30.29 v11.81,31.18 12.7,30.29 13.97,30.29 14.61,29.65 v14.61,29.21
VIN
  Top 0.406: K2$DNP.14 M1$DNP.14
VOUTL
  Top 0.254: R1.1 10.92,20.19 10.54,19.81 6.99,19.81 6.01,18.84 IC5.14
  Top 0.305: R1.1 R3.2
VOUTR
  Top 0.254: R4.2 5.33,20.19 4.71,19.57 IC5.16
  Top 0.305: R4.2 R2.2
VRAW
  Top 0.61: Q1.3 56.26,21.84 53.98,24.13 K1.PWR
  Top 0.762: K6$DNP.1 55.56,32.96 57.28,31.24 57.28,27.77 K1.PWR
VREF
  Top 0.305: IC5.12 7.31,16.45 6.86,16 2.54,16 C11.1 2.67,16.33 C1.2
WCLK  (via drill 0.38)
  Top 0.203: IC1.5 11.36,6.03 v11.56,6.22
  Top 0.406: K2$DNP.6 M1$DNP.6
  Bottom 0.203: K2$DNP.6 19.24,22.61 18.41,21.78 18.41,7.24 18.1,6.92 18.1,4.57 17.78,4.25 16.64,4.25 14.67,6.22 v11.56,6.22

### Text on the board
tPlace: R | L | P2 | P1 | - | + | P3 | P0 | P4 | CTS | SCL | TXD | SDA | RXD | P5 | RTS | D- | P6 | D+ | A7 | SCK | A5 | SEL | A3 | MISO | A2 | MOSI | A1 | 3v3 | A0 | V | IN | GND | MicroSD
bPlace: - | + | logiblock.com/boards | 5V 16V | ~
tTest: Logiblock.com AudioBlock Board | 0BAC-0606 (Top Side) | (DNP AT FACTORY)